# Altium schematic sheet IN.SchDoc
size A
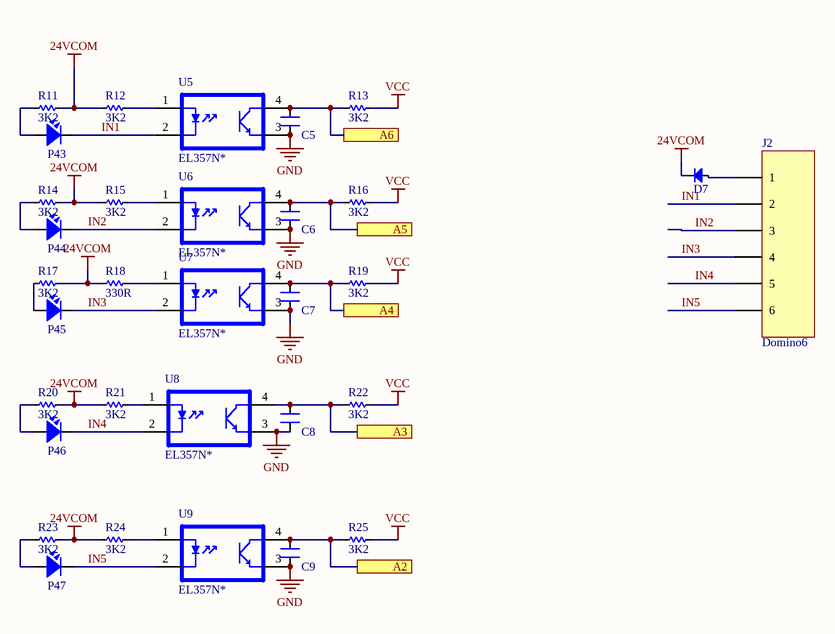
[diagram p0: IN.SchDoc]

## Parts
C5  100nF  [CN-SMD-0805]  (value not drawn)
C6  100nF  [CN-SMD-0805]  (value not drawn)
C7  100nF  [CN-SMD-0805]  (value not drawn)
C8  100nF  [CN-SMD-0805]  (value not drawn)
C9  100nF  [CN-SMD-0805]  (value not drawn)
D7  Diode  [DIO-SMD-123]  (value not drawn)
J2  Domino6  [KF6-5.08T]
P43  LED  [LED-0805-Green]  (value not drawn)
P44  LED  [LED-0805-Green]  (value not drawn)
P45  LED  [LED-0805-Green]  (value not drawn)
P46  LED  [LED-0805-Green]  (value not drawn)
P47  LED  [LED-0805-Green]  (value not drawn)
R11  3K2  [RES-SMD-0805]
R12  3K2  [RES-SMD-0805]
R13  3K2  [RES-SMD-0805]
R14  3K2  [RES-SMD-0805]
R15  3K2  [RES-SMD-0805]
R16  3K2  [RES-SMD-0805]
R17  3K2  [RES-SMD-0805]
R18  330R  [RES-SMD-0805]
R19  3K2  [RES-SMD-0805]
R20  3K2  [RES-SMD-0805]
R21  3K2  [RES-SMD-0805]
R22  3K2  [RES-SMD-0805]
R23  3K2  [RES-SMD-0805]
R24  3K2  [RES-SMD-0805]
R25  3K2  [RES-SMD-0805]
U5  EL357N*  [SOP4N]
U6  EL357N*  [SOP4N]
U7  EL357N*  [SOP4N]
U8  EL357N*  [SOP4N]
U9  EL357N*  [SOP4N]

## Ports
A2, A3, A4, A5, A6

## Nets
24VCOM: D7.2(K) R11.1 R12.1 R14.1 R15.1 R17.1 R18.1 R20.1 R21.1 R23.1 R24.1
GND: C5.2 C6.2 C7.2 C8.2 C9.2 U5.3(E) U6.3(E) U7.3(E) U8.3(E) U9.3(E)
VCC: R13.2 R16.2 R19.2 R22.2 R25.2
A2: C9.1 R25.1 U9.4(C) ; port A2
A3: C8.1 R22.1 U8.4(C) ; port A3
A4: C7.1 R19.1 U7.4(C) ; port A4
A5: C6.1 R16.1 U6.4(C) ; port A5
A6: C5.1 R13.1 U5.4(C) ; port A6
IN1: J2.2 P43.2 U5.2(K)
IN2: J2.3 P44.2 U6.2(K)
IN3: J2.4 P45.2 U7.2(K)
IN4: J2.5 P46.2 U8.2(K)
IN5: J2.6 P47.2 U9.2(K)
NetD7_1: D7.1(A) J2.1
NetP43_1: P43.1 R11.2
NetP44_1: P44.1 R14.2
NetP45_1: P45.1 R17.2
NetP46_1: P46.1 R20.2
NetP47_1: P47.1 R23.2
NetR12_2: R12.2 U5.1(A)
NetR15_2: R15.2 U6.1(A)
NetR18_2: R18.2 U7.1(A)
NetR21_2: R21.2 U8.1(A)
NetR24_2: R24.2 U9.1(A)

## Library data of the parts
C5-C9 = CN: Value: 33pF
D7 = Diode: Default Diode; Code - JEDEC: DO-214-AB; Value: 1N5007; Published: 8-Jun-2000; Revision: July-2002: Re-released for DXP Platform.; Publisher: Altium Limited; ComponentLink1Description: ES1J - STMBL; ComponentLink1URL: https://banlinhkien.vn/goods-8089-es1j-do214-diode-1a-600v-sma-es1j-.html
J2 = Domino6: Manufacturer: W¨¹rth Elektronik eiSos GmbH; PartNo: 691133710006; ComponentLink1 Description: Manufacturer; ComponentLink2 Description: Datasheet; NoPins: 6; ComponentLink1 URL: http://www.we-online.com; ComponentLink2 URL: http://katalog.we-online.de/em/datasheet/6911337100xx.pdf; Created By: Baojun Chen; Created Date: 4-Aug-15
P43-P47 = LED SMD: Value: LED 3 - 5 ly 2 Colour
R11-R25 = R
U5-U9 = EL357N(A)(TA)-G: Optoisolator Transistor Output 3750Vrms 1 Channel 4-SOP _2.54mm_; MP: EL357N_A__TA_-G; MF: Everlight Electronics; Package: SOP-4 Everlight; Availability: Unavailable; SnapEDA_Link: https://www.snapeda.com/parts/EL357N%28A%29%28TA%29-G/Everlight%20Electronics%20Co%20Ltd/view-part/579256/?ref=snap; Price: None; Value: *